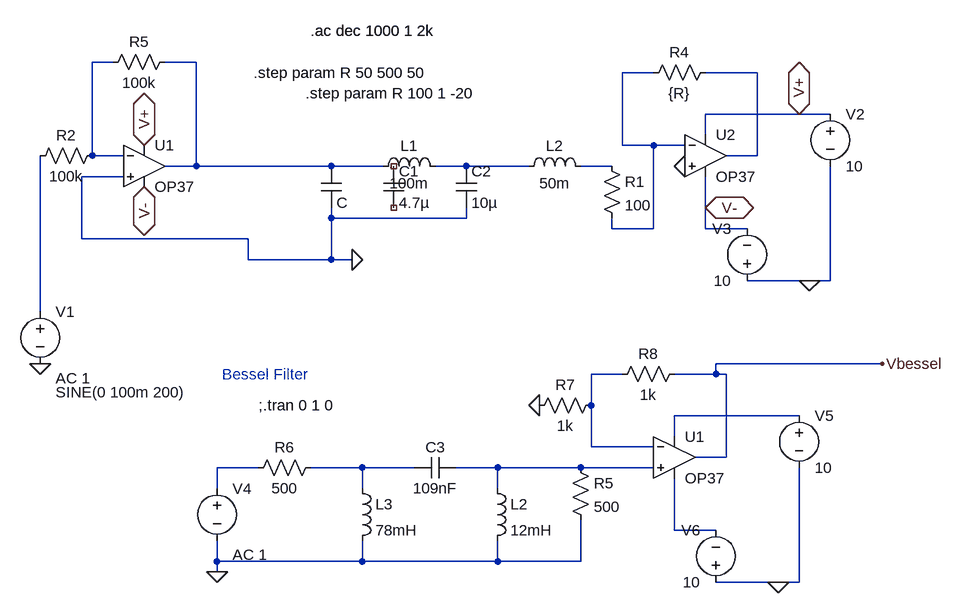
[diagram p0: schematic LowPass.asc]
LowPass.asc, the LTspice schematic file:
Version 4
<<<<<<< HEAD
SHEET 1 1036 680
WIRE -128 112 -160 112
WIRE 0 112 -48 112
=======
SHEET 1 1152 928
>>>>>>> origin/master
WIRE 704 128 656 128
WIRE 864 128 784 128
WIRE 928 192 784 192
WIRE 976 192 928 192
WIRE 784 224 784 192
WIRE 656 240 656 128
WIRE 704 240 656 240
WIRE 752 240 704 240
WIRE -160 256 -160 112
WIRE -112 256 -160 256
WIRE 864 256 864 128
WIRE 864 256 816 256
WIRE 0 272 0 112
WIRE 0 272 -48 272
WIRE 208 272 0 272
WIRE 288 272 208 272
WIRE 416 272 368 272
WIRE 512 272 416 272
WIRE 640 272 592 272
WIRE -112 288 -176 288
WIRE 784 336 784 288
WIRE 208 352 208 336
WIRE 416 352 416 336
WIRE 416 352 208 352
WIRE 640 368 640 352
WIRE 704 368 704 240
WIRE 704 368 640 368
WIRE 784 368 784 336
WIRE 848 368 784 368
WIRE -176 384 -176 288
WIRE 80 384 -176 384
WIRE 80 416 80 384
WIRE 208 416 208 352
WIRE 208 416 80 416
WIRE 240 416 208 416
WIRE 944 448 848 448
WIRE 976 448 976 272
WIRE 976 448 944 448
<<<<<<< HEAD
WIRE -240 496 -240 256
=======
WIRE 1056 576 800 576
WIRE 656 592 608 592
WIRE 800 592 800 576
WIRE 800 592 736 592
WIRE 816 592 800 592
WIRE 608 640 608 592
WIRE 928 656 736 656
WIRE 736 688 736 656
WIRE 608 704 608 640
WIRE 704 704 608 704
WIRE 816 720 816 592
WIRE 816 720 768 720
WIRE 96 736 32 736
WIRE 256 736 176 736
WIRE 336 736 256 736
WIRE 464 736 400 736
WIRE 592 736 464 736
WIRE 704 736 592 736
WIRE 32 768 32 736
WIRE 256 768 256 736
WIRE 464 768 464 736
WIRE 736 832 736 752
WIRE 800 832 736 832
WIRE 32 880 32 848
WIRE 256 880 256 848
WIRE 256 880 32 880
WIRE 464 880 464 848
WIRE 464 880 256 880
WIRE 592 880 592 816
WIRE 592 880 464 880
WIRE 32 896 32 880
WIRE 896 912 800 912
WIRE 928 912 928 736
WIRE 928 912 896 912
>>>>>>> origin/master
FLAG 240 416 0
FLAG 944 448 0
<<<<<<< HEAD
FLAG 928 192 V+
IOPIN 928 192 BiDir
FLAG 784 336 V-
IOPIN 784 336 BiDir
FLAG -80 240 V+
IOPIN -80 240 BiDir
FLAG -80 304 V-
IOPIN -80 304 BiDir
FLAG -240 576 0
FLAG 752 272 0
SYMBOL cap 192 272 R0
=======
FLAG 32 896 0
FLAG 528 640 0
FLAG 896 912 0
FLAG 1056 576 Vbessel
SYMBOL cap 288 272 R0
>>>>>>> origin/master
SYMATTR InstName C1
SYMATTR Value 4.7µ
SYMBOL cap 400 272 R0
SYMATTR InstName C2
SYMATTR Value 10µ
SYMBOL ind 272 288 R270
WINDOW 0 32 56 VTop 2
WINDOW 3 5 56 VBottom 2
SYMATTR InstName L1
SYMATTR Value 100m
SYMBOL res 624 256 R0
SYMATTR InstName R1
SYMATTR Value 100
SYMBOL res 688 144 R270
WINDOW 0 32 56 VTop 2
WINDOW 3 0 56 VBottom 2
SYMATTR InstName R4
SYMATTR Value {R}
SYMBOL Opamps/OP37 784 192 R0
SYMATTR InstName U2
SYMBOL voltage 976 176 R0
SYMATTR InstName V2
SYMATTR Value 10
SYMBOL voltage 848 464 R180
WINDOW 0 24 96 Left 2
WINDOW 3 24 16 Left 2
SYMATTR InstName V3
SYMATTR Value 10
<<<<<<< HEAD
SYMBOL Opamps/OP37 -80 208 R0
SYMATTR InstName U1
SYMBOL res -144 240 R90
WINDOW 0 0 56 VBottom 2
WINDOW 3 32 56 VTop 2
SYMATTR InstName R2
SYMATTR Value 100k
SYMBOL res -32 96 R90
WINDOW 0 0 56 VBottom 2
WINDOW 3 32 56 VTop 2
SYMATTR InstName R5
SYMATTR Value 100k
SYMBOL voltage -240 480 R0
WINDOW 3 24 140 Left 2
WINDOW 123 24 118 Left 2
SYMATTR Value SINE(0 100m 200)
SYMATTR Value2 AC 1
SYMATTR InstName V1
SYMBOL ind 496 288 R270
WINDOW 0 32 56 VTop 2
WINDOW 3 5 56 VBottom 2
SYMATTR InstName L2
SYMATTR Value 50m
TEXT 176 64 Left 2 !.ac dec 1000 1 2k
TEXT 96 640 Left 2 !;.tran 0 1 0
TEXT 168 160 Left 2 !.step param R 100 1 -20
=======
SYMBOL cap 400 720 R90
WINDOW 0 0 32 VBottom 2
WINDOW 3 32 32 VTop 2
SYMATTR InstName C3
SYMATTR Value 109nF
SYMBOL ind 448 752 R0
SYMATTR InstName L2
SYMATTR Value 12mH
SYMBOL res 576 720 R0
SYMATTR InstName R5
SYMATTR Value 500
SYMBOL res 80 752 R270
WINDOW 0 32 56 VTop 2
WINDOW 3 0 56 VBottom 2
SYMATTR InstName R6
SYMATTR Value 500
SYMBOL voltage 32 752 R0
WINDOW 123 24 118 Left 2
SYMATTR Value2 AC 1
SYMATTR InstName V4
SYMATTR Value ""
SYMBOL res 512 656 R270
WINDOW 0 32 56 VTop 2
WINDOW 3 0 56 VBottom 2
SYMATTR InstName R7
SYMATTR Value 1k
SYMBOL res 640 608 R270
WINDOW 0 32 56 VTop 2
WINDOW 3 0 56 VBottom 2
SYMATTR InstName R8
SYMATTR Value 1k
SYMBOL Opamps/OP37 736 656 R0
SYMATTR InstName U1
SYMBOL voltage 928 640 R0
SYMATTR InstName V5
SYMATTR Value 10
SYMBOL voltage 800 928 R180
WINDOW 0 24 96 Left 2
WINDOW 3 24 16 Left 2
SYMATTR InstName V6
SYMATTR Value 10
SYMBOL ind 240 752 R0
SYMATTR InstName L3
SYMATTR Value 78mH
TEXT 176 64 Left 2 !.ac dec 1000 1 2k
TEXT 88 128 Left 2 !.step param R 50 500 50
TEXT 40 592 Left 2 ;Bessel Filter
>>>>>>> origin/master

The netlist it stands for:
* LowPass.asc
C§? N002 0 C
C1 NC_01 NC_02 4.7µ
C2 N005 0 10µ
L1 N002 N005 100m
R1 N006 N003 100
R4 N003 N004 {R}
XU2 0 N003 V+ V- N004 LT1037  ; OP37, pins In+ In- V+ V- OUT
V2 V+ 0 10
V3 0 V- 10
XU1 0 N001 V+ V- N002 LT1037  ; OP37, pins In+ In- V+ V- OUT
R2 N001 N007 100k
R5 N002 N001 100k
V1 N007 0 SINE(0 100m 200) AC 1
L2 N005 N006 50m
C3 N012 N011 109nF
L2 N012 0 12mH
R5 N012 0 500
R6 N010 N011 500
V4 N010 0 AC 1
R7 0 N008 1k
R8 N008 Vbessel 1k
XU1 N012 N008 N009 N013 Vbessel LT1037  ; OP37, pins In+ In- V+ V- OUT
V5 N009 0 10
V6 0 N013 10
L3 N011 0 78mH
.ac dec 1000 1 2k
;.tran 0 1 0
.step param R 100 1 -20
.ac dec 1000 1 2k
.step param R 50 500 50
* Bessel Filter
.lib LTC.lib
.backanno
.end